# EAGLE design Teensy_v1.3 (EAGLE 7.7.0)
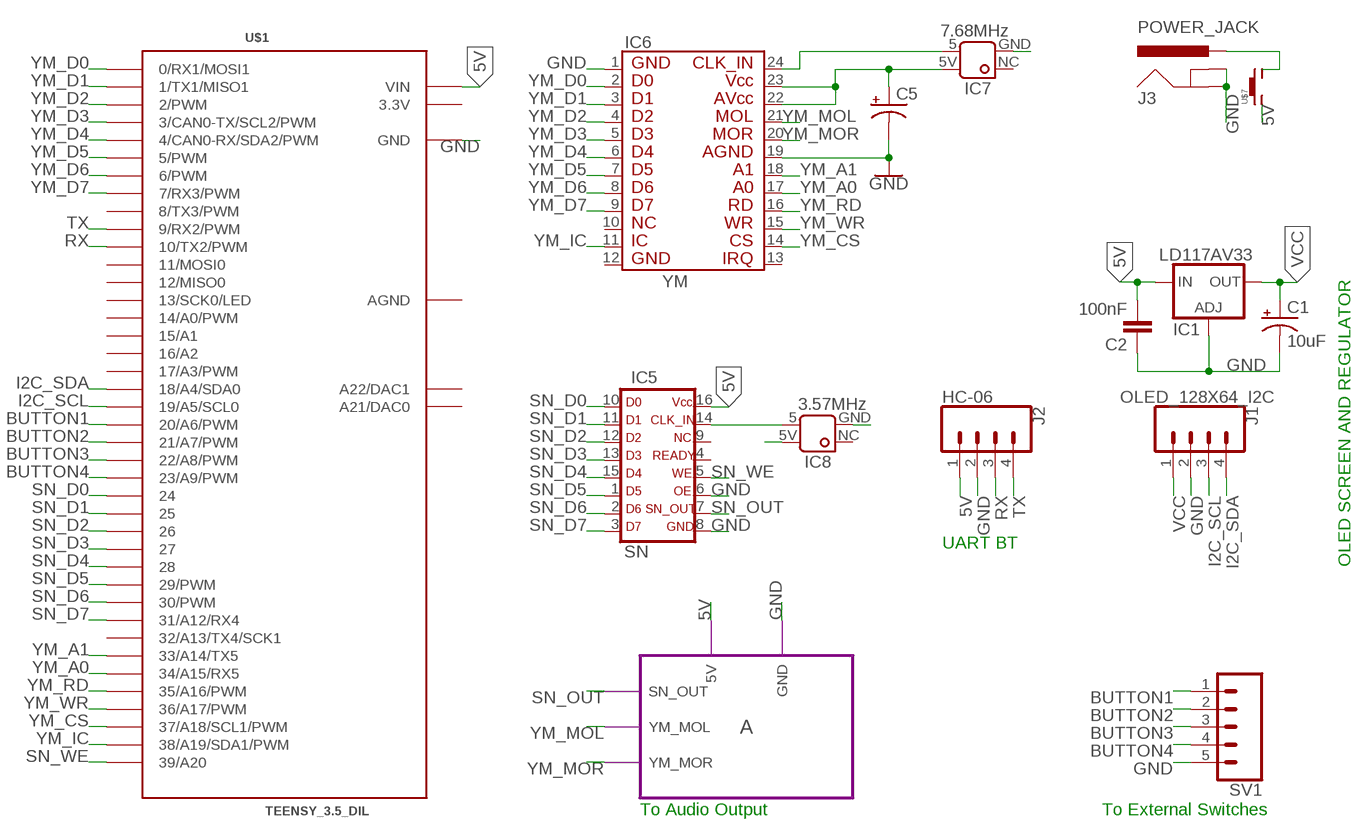
[diagram p0: schematic, sheet 1]

## Parts
C1  10uF  CPOL-USE2-5  [E2-5]
C2  100nF  C-EU025-025X050  [C025-025X050]
C5  1000uF  CPOL-USE5-10.5  [E5-10,5]
IC1  LD117AV33  [TO220L1]
IC5  SN  SN76489  [DIL16]
IC6  YM  YM2612-6  [DIL24-6]
IC7  7.68MHz  CLOCK_OSC  [DIL08-CLK]
IC8  3.57MHz  CLOCK_OSC  [DIL08-CLK]
J1  OLED_128X64_I2C  CONN_04  [1X04]
J2  HC-06  CONN_04  [1X04]
J3  POWER_JACK  [POWER_JACK_PTH]
SV1  CONN_05  [1X05]
U$1  TEENSY_3.5_DIL  [TEENSY_3.5_DIL]
U$7  GPTS20  [GPTS]

## Module instances
A = AMP

## Nets
5V [power]: C2.2 C5.+ IC1.3(IN) IC5.16(V) IC6.22 IC6.23 IC7.5V IC8.5V J2.1 U$1.VIN U$7.P$1 ; port A.5V
BUTTON1: SV1.1 U$1.20/A6(20/A6/PWM)
BUTTON2: SV1.2 U$1.21/A7(21/A7/PWM)
BUTTON3: SV1.3 U$1.22/A8(22/A8/PWM)
BUTTON4: SV1.4 U$1.23/A9(23/A9/PWM)
GND [power]: C1.- C2.1 C5.- IC1.1(ADJ) IC5.6(OE) IC5.8(GND) IC6.1 IC6.19 IC7.GND IC8.GND J1.2 J2.2 J3.GND J3.GNDBREAK SV1.5 U$1.GND U$1.GND1(GND) ; port A.GND
I2C_SCL: J1.3 U$1.19/A5(19/A5/SCL0)
I2C_SDA: J1.4 U$1.18/A4(18/A4/SDA0)
N$1: IC6.24 IC7.5
N$3 [power]: J3.PWR U$7.P$2
N$11: IC5.14(CLK) IC8.5
RX: J2.3 U$1.10(10/TX2/PWM)
SN_D0: IC5.10(D0) U$1.24
SN_D1: IC5.11(D1) U$1.25
SN_D2: IC5.12(D2) U$1.26
SN_D3: IC5.13(D3) U$1.27
SN_D4: IC5.15(D4) U$1.28
SN_D5: IC5.1(D5) U$1.29(29/PWM)
SN_D6: IC5.2(D6) U$1.30(30/PWM)
SN_D7: IC5.3(D7) U$1.31/A12(31/A12/RX4)
SN_OUT: IC5.7(SN) ; port A.SN_OUT
SN_WE: IC5.5(WE) U$1.39/A20
TX: J2.4 U$1.9(9/RX2/PWM)
VCC [power]: C1.+ IC1.2(OUT) J1.1
YM_A0: IC6.17 U$1.34/A15(34/A15/RX5)
YM_A1: IC6.18 U$1.33/A14(33/A14/TX5)
YM_CS: IC6.14 U$1.37/A18(37/A18/SCL1/PWM)
YM_D0: IC6.2 U$1.0(0/RX1/MOSI1)
YM_D1: IC6.3 U$1.1(1/TX1/MISO1)
YM_D2: IC6.4 U$1.2(2/PWM)
YM_D3: IC6.5 U$1.3(3/CAN0-TX/SCL2/PWM)
YM_D4: IC6.6 U$1.4(4/CAN0-RX/SDA2/PWM)
YM_D5: IC6.7 U$1.5(5/PWM)
YM_D6: IC6.8 U$1.6(6/PWM)
YM_D7: IC6.9 U$1.7(7/RX3/PWM)
YM_IC: IC6.11 U$1.38/A19(38/A19/SDA1/PWM)
YM_MOL: IC6.21 ; port A.YM_MOL
YM_MOR: IC6.20 ; port A.YM_MOR
YM_RD: IC6.16 U$1.35/A16(35/A16/PWM)
YM_WR: IC6.15 U$1.36/A17(36/A17/PWM)
Unconnected: IC5.4(RDY) IC5.9(NC) IC6.10 IC6.12 IC6.13 IC7.NC IC8.NC U$1.8(8/TX3/PWM) U$1.11(11/MOSI0) U$1.12(12/MISO0) U$1.13(13/SCK0/LED) U$1.14/A0(14/A0/PWM) U$1.15/A1 U$1.16/A2 U$1.17/A3(17/A3/PWM) U$1.32/A13(32/A13/TX4/SCK1) U$1.A21(A21/DAC0) U$1.A22(A22/DAC1)

## Notes on the sheet
- UART BT
- OLED SCREEN AND REGULATOR
- To Audio Output | To External Switches

## Power pins joined to a net without a drawn wire
3.3V: U$1.3.3V
AGND: U$1.AGND

## Library data of the parts
C1 = resistor:CPOL-US: POLARIZED CAPACITOR, American symbol; HEIGHT: 6.5
C2 = resistor:C-EU: CAPACITOR, European symbol; HEIGHT: 3
C5 = resistor:CPOL-US: POLARIZED CAPACITOR, American symbol; HEIGHT: 17.5
IC1 = v-reg:LD117A?*: Low drop fixed and adjustable positive voltage regulators 1 A Source: http://www.st.com/stonline/products/literature/ds/7194/ld1117axx.pdf
IC5 = Sega:SN76489: SN76489 Texas Instruments SN76489 PSG 16 DIP, Requires 3.57 MHz Clock 3 square wave tone generators. A wide range of frequencies. 16 different volume levels. 1 noise generator. 2 types (white noise and periodic). 3 different frequencies. 16 different volume levels. https://en.wikipedia.org/wiki/Texas_Instruments_SN76489; HEIGHT: 4.2
IC6 = Sega:YM2612: YM2612 Sound chip found in the Sega Genesis 24 DIP Package (OBN2); HEIGHT: 4.2
IC7 IC8 = Sega:CLOCK_OSC: CLOCK OSCILLATOR Dual In Line / Package; HEIGHT: 5.4
J1 J2 = SparkFun-Connectors:CONN_04: Multi connection point. Often used as Generic Header-pin footprint for 0.1 inch spaced/style header connections On any of the 0.1 inch spaced packages, you can populate with these: Break Away Headers - Straight <https://www.sparkfun.com/products/116> (PRT-00116) Break Away Male Headers - Right Angle <https://www.sparkfun.com/products/553> (PRT-00553) Female Headers <https://www.sparkfun.com/products/115> (PRT-00115) Break Away Headers - Machine Pin <https://www.sparkfun.com/products/117> (PRT-00117) Break Away Female Headers - Swiss Machine Pin <https://www.sparkfun.com/products/743> (PRT-00743) For SCREWTERMINALS and SPRING TERMINALS visit here: Screw Terimnals on SparkFun.com <https://www.sparkfun.com/search/results?term=Screw+Terminals> (5mm/3.5mm/2.54mm spacing) This device is also useful as a general connection point to wire up your design to another part of your project. Our various solder wires solder well into these plated through hole pads. Hook-Up Wire - Assortment (Stranded, 22 AWG) <https://www.sparkfun.com/products/11375> (PRT-11375) Hook-Up Wire - Assortment (Solid Core, 22 AWG) <https://www.sparkfun.com/products/11367> (PRT-11367) View the entire wire category on our website here <https://www.sparkfun.com/categories/141> Special notes: Molex polarized connector foot print use with SKU : PRT-08231 with associated crimp pins and housings. 1MM SMD Version SKU: PRT-10208; PROD_ID: CONN-09696
J3 = Sega:POWER_JACK: Power Jack Connector This is the standard 5.5mm barrel jack for power. The PTH is the most common, proven, reliable, footprint. The Slot footprint only works if the mill layer is transmitted to the PCB fab house so be warned. Here are the connectors we sell at SparkFun: DC Barrel Power Jack/Connector <https://www.sparkfun.com/products/119> (PRT-00119) DC Barrel Power Jack/Connector (SMD) <https://www.sparkfun.com/products/12748> (PRT-12748) DC Barrel Jack Adapter - Breadboard Compatible <https://www.sparkfun.com/products/10811> (PRT-10811) It is used on this SparkFun product (and many, many others): SparkFun RedBoard - Programmed with Arduino <https://www.sparkfun.com/products/12757> (DEV-12757) Also, if you need a mating power supply or connector, please check these out: Wall Adapter Power Supply - 9VDC 650mA <https://www.sparkfun.com/products/298> (TOL-00298) DC Barrel Jack Adapter - Male <https://www.sparkfun.com/products/10287> (PRT-10287); HEIGHT: 11
SV1 = SparkFun-Connectors:CONN_05: Multi connection point. Often used as Generic Header-pin footprint for 0.1 inch spaced/style header connections On any of the 0.1 inch spaced packages, you can populate with these: Break Away Headers - Straight <https://www.sparkfun.com/products/116> (PRT-00116) Break Away Male Headers - Right Angle <https://www.sparkfun.com/products/553> (PRT-00553) Female Headers <https://www.sparkfun.com/products/115> (PRT-00115) Break Away Headers - Machine Pin <https://www.sparkfun.com/products/117> (PRT-00117) Break Away Female Headers - Swiss Machine Pin <https://www.sparkfun.com/products/743> (PRT-00743) For SCREWTERMINALS and SPRING TERMINALS visit here: Screw Terimnals on SparkFun.com <https://www.sparkfun.com/search/results?term=Screw+Terminals> (5mm/3.5mm/2.54mm spacing) This device is also useful as a general connection point to wire up your design to another part of your project. Our various solder wires solder well into these plated through hole pads. Hook-Up Wire - Assortment (Stranded, 22 AWG) <https://www.sparkfun.com/products/11375> (PRT-11375) Hook-Up Wire - Assortment (Solid Core, 22 AWG) <https://www.sparkfun.com/products/11367> (PRT-11367) View the entire wire category on our website here <https://www.sparkfun.com/categories/141> Special notes: Molex polarized connector foot print use with SKU : PRT-08231 with associated crimp pins and housings. 1MM SMD Version SKU: PRT-10208
U$1 = Teensy_3_and_LC_Series_Boards_v1.4:TEENSY_3.5_DIL: DIL version of the Teensy 3.5; HEIGHT: 4.2
U$7 = Sega:GPTS20: PUSH BUTTON SPST GPTS203212B Digi-Key Part Number CW182-ND http://switches-connectors-custom.cwind.com/Asset/GPTS203212BR2.pdf; HEIGHT: 12

## Module AMP
Ports: SN_OUT(io) YM_MOL(io) YM_MOR(io) 5V(io) GND(io)
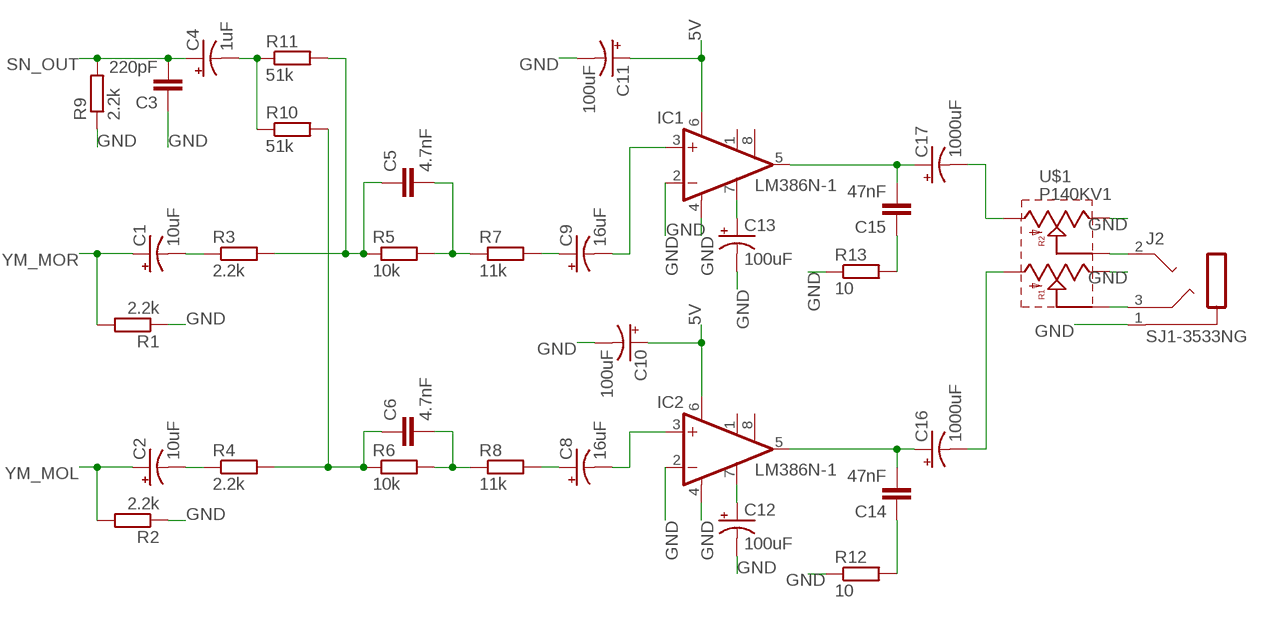
[diagram p1: schematic, module AMP, sheet 1]

### Parts
C1  10uF  CPOL-USE2-5  [E2-5]
C2  10uF  CPOL-USE2-5  [E2-5]
C3  220pF  C-EU025-025X050  [C025-025X050]
C4  1uF  CPOL-USE2-5  [E2-5]
C5  4.7nF  C-EU025-025X050  [C025-025X050]
C6  4.7nF  C-EU025-025X050  [C025-025X050]
C8  16uF  CPOL-USE5-10.5  [E5-10,5]
C9  16uF  CPOL-USE5-10.5  [E5-10,5]
C10  100uF  CPOL-USE2-5  [E2-5]
C11  100uF  CPOL-USE2-5  [E2-5]
C12  100uF  CPOL-USE2-5  [E2-5]
C13  100uF  CPOL-USE2-5  [E2-5]
C14  47nF  C-EU025-025X050  [C025-025X050]
C15  47nF  C-EU025-025X050  [C025-025X050]
C16  1000uF  CPOL-USE5-10.5  [E5-10,5]
C17  1000uF  CPOL-USE5-10.5  [E5-10,5]
IC1  LM386N-1  [DIL08]
IC2  LM386N-1  [DIL08]
J2  SJ1-3533NG  [SJ1-3533NG]
R1  2.2k  R-EU_0204/7  [0204/7]
R2  2.2k  R-EU_0204/7  [0204/7]
R3  2.2k  R-EU_0204/7  [0204/7]
R4  2.2k  R-EU_0204/7  [0204/7]
R5  10k  R-EU_0204/7  [0204/7]
R6  10k  R-EU_0204/7  [0204/7]
R7  11k  R-EU_0204/7  [0204/7]
R8  11k  R-EU_0204/7  [0204/7]
R9  2.2k  R-EU_0204/7  [0204/7]
R10  51k  R-EU_0204/7  [0204/7]
R11  51k  R-EU_0204/7  [0204/7]
R12  10  R-EU_0204/7  [0204/7]
R13  10  R-EU_0204/7  [0204/7]
U$1  P140KV1  [P14O]

### Nets
5V [power]: C10.+ C11.+ IC1.6(VS) IC2.6(VS)
GND [power]: C3.1 C10.- C11.- C12.- C13.- IC1.2(-IN) IC1.4(GND) IC2.2(-IN) IC2.4(GND) J2.1(S) R1.1 R2.1 R9.1 R12.1 R13.1 U$1.3 U$1.3'
N$1: C16.- U$1.1
N$2: C17.- U$1.1'
N$3: C15.2 C17.+ IC1.5(OUT)
N$4: C14.2 C16.+ IC2.5(OUT)
N$5: C13.+ IC1.7(BYPASS)
N$6: C12.+ IC2.7(BYPASS)
N$7: C9.- IC1.3(+IN)
N$8: C8.- IC2.3(+IN)
N$9: C9.+ R7.2
N$10: C8.+ R8.2
N$11: C15.1 R13.2
N$12: C14.1 R12.2
N$13: C6.1 R4.2 R6.1 R10.2
N$14: C5.1 R3.2 R5.1 R11.2
N$15: C4.- R10.1 R11.1
N$16: C1.- R3.1
N$17: C2.- R4.1
N$18: C5.2 R5.2 R7.1
N$19: C6.2 R6.2 R8.1
N$20: J2.2(T) U$1.2'
N$21: J2.3(R) U$1.2
SN_OUT: C3.2 C4.+ R9.2
YM_MOL: C2.+ R2.2
YM_MOR: C1.+ R1.2
Unconnected: IC1.1(GAIN) IC1.8(GAIN) IC2.1(GAIN) IC2.8(GAIN)

### Library data of the parts
C1 C2 = resistor:CPOL-US: POLARIZED CAPACITOR, American symbol; HEIGHT: 6.5
C3 C5 C6 C14 C15 = resistor:C-EU: CAPACITOR, European symbol; HEIGHT: 3
C4 = resistor:CPOL-US: POLARIZED CAPACITOR, American symbol
C8 C9 = resistor:CPOL-US: POLARIZED CAPACITOR, American symbol; HEIGHT: 26.5
C10 C11 = resistor:CPOL-US: POLARIZED CAPACITOR, American symbol; HEIGHT: 12.7
C12 C13 = resistor:CPOL-US: POLARIZED CAPACITOR, American symbol; HEIGHT: 12.5
C16 C17 = resistor:CPOL-US: POLARIZED CAPACITOR, American symbol; HEIGHT: 17.5
IC1 IC2 = linear:LM386?-*: Low Voltage Audio Power Amplifier Source: http://cache.national.com/ds/LM/LM386.pdf; HEIGHT: 4.2
J2 = con-cuistack:SJ1-3533NG: RIGHT ANGLE STEREO JACK 3.5mm; HEIGHT: 12.3
R1-R7 R9-R13 = resistor:R-EU_: RESISTOR, European symbol; HEIGHT: 1.5
R8 = resistor:R-EU_: RESISTOR, European symbol
U$1 = Sega:P140KV1: DUAL GANG POT 10K OHM 1/20W PLASTIC LINEAR DigiKEy PN:987-1296-ND http://www.ttelectronics.com/sites/default/files/download-files/Datasheet_RotaryPanelPot_P140series.pdf; HEIGHT: 16.7

## Net classes
0 default: width 0.61 mm
1 power: width 1.016 mm, clearance 0.254 mm

## Board
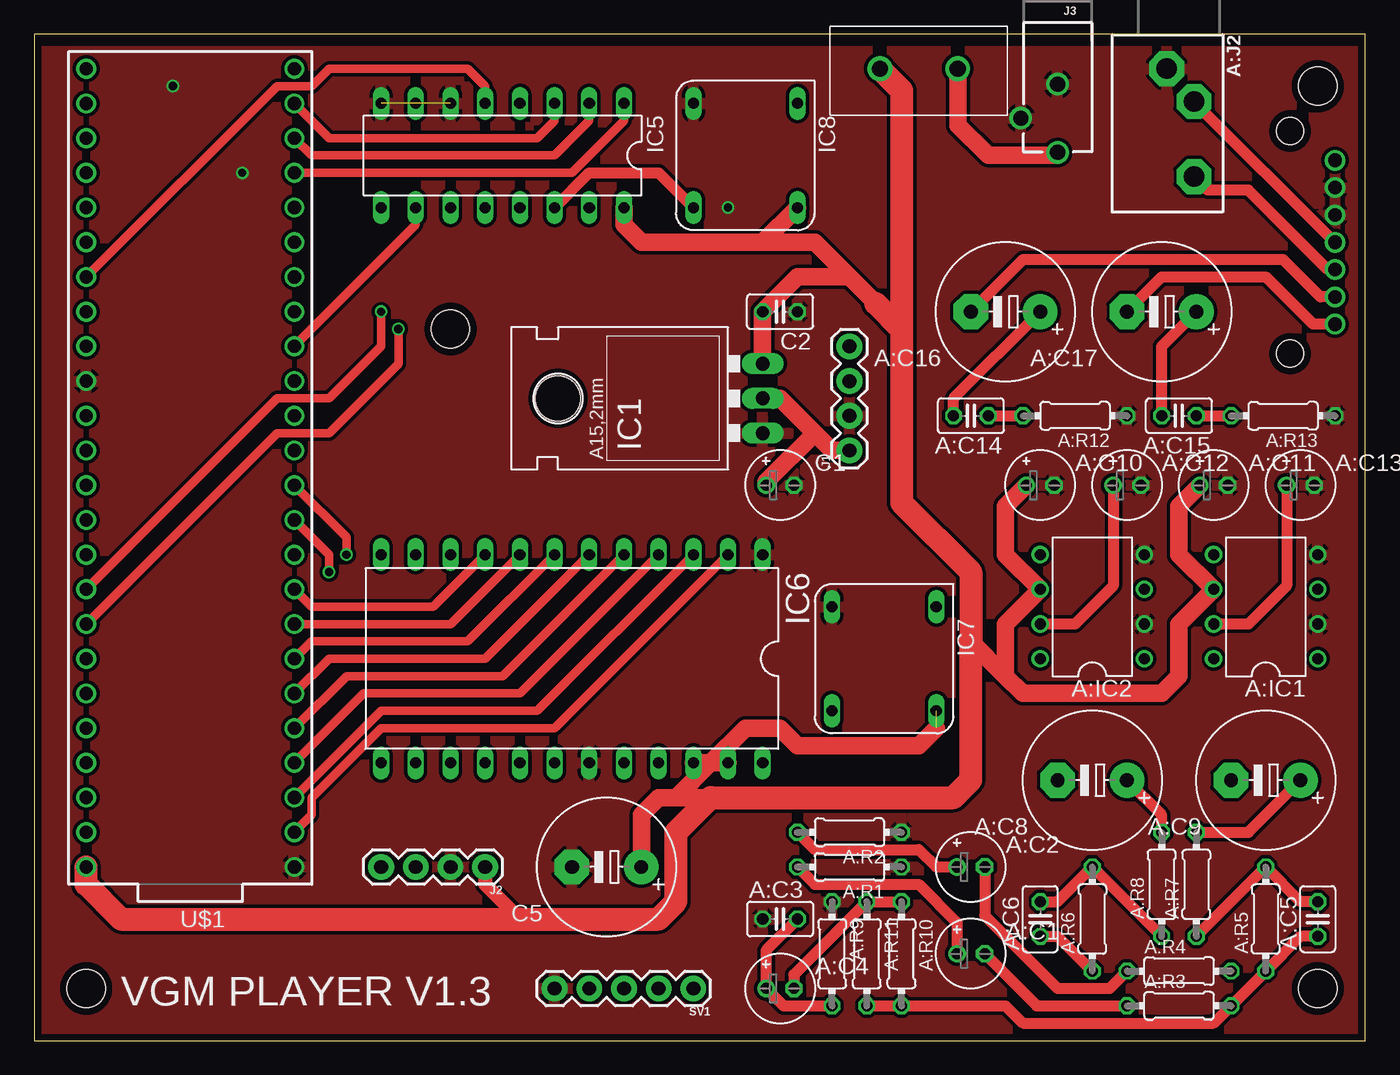
[diagram p2: board, top side]
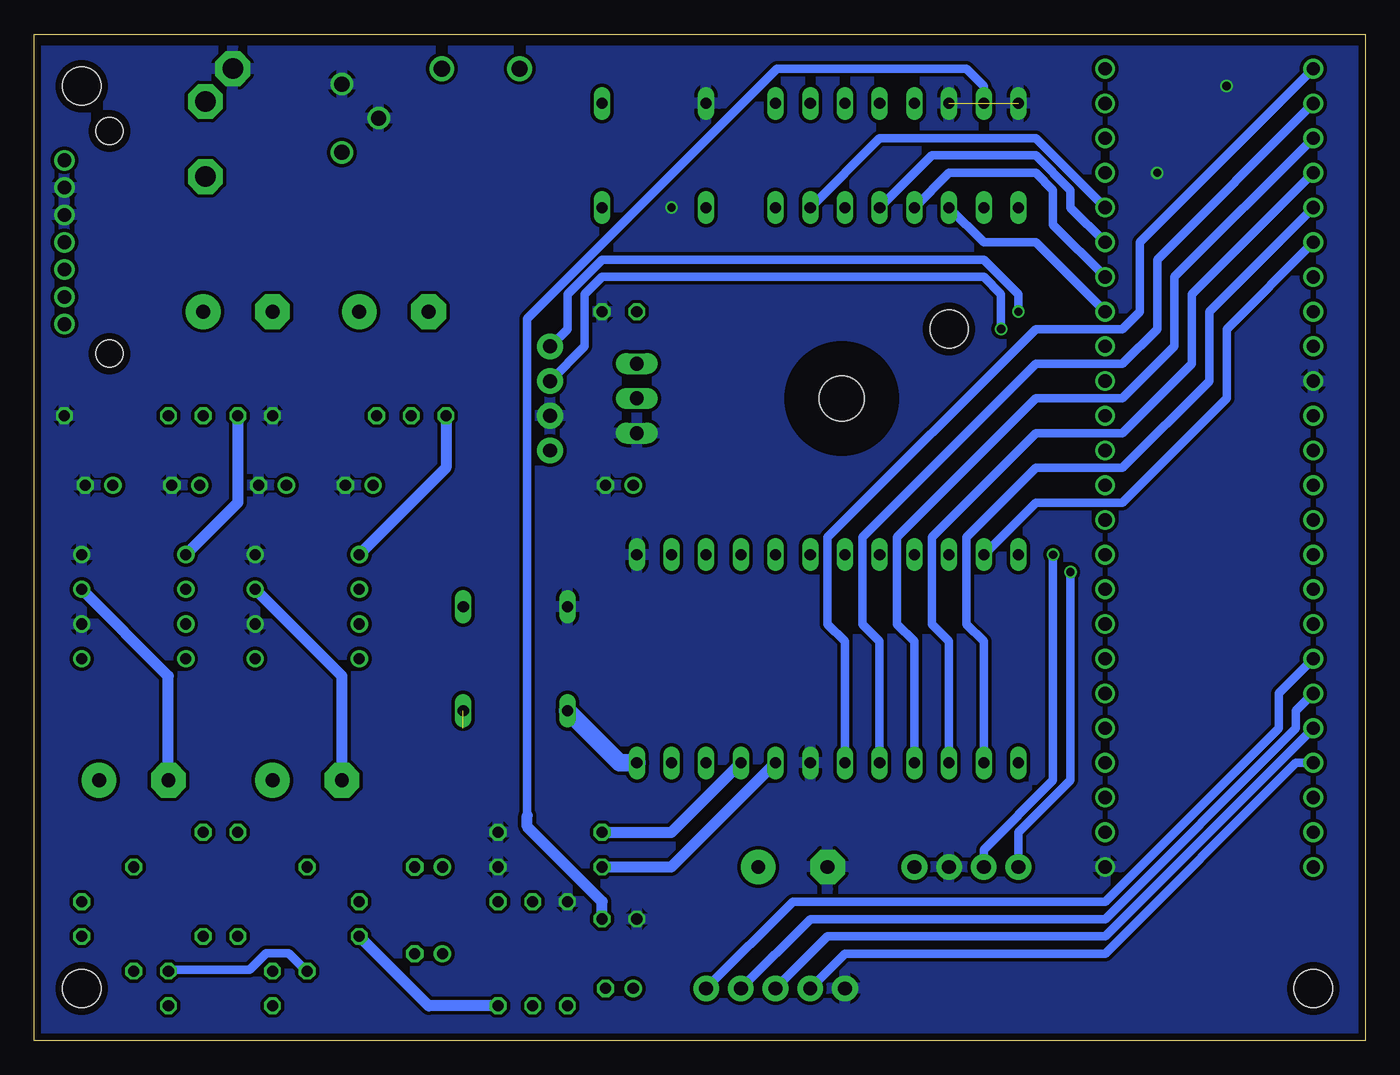
[diagram p3: board, bottom side, seen from below]

Size 97.46 x 73.65 mm. Coordinates in mm from the lower left corner, seen from the top.
Outline: 0,0 97.46,0 97.46,73.65 0,73.65 0,0
Copper layers (1*16): Top 0.035mm / dielectric 1.6mm / Bottom 0.035mm
Design rules "Elecrow_2-layer_PCB_eagle_rule": minimum track width 6mil, minimum drill 12mil, track to track 6mil, track to pad 6mil, pad to pad 6mil, via to via 8mil, smd to smd 0mil, copper to edge 20mil, drill to drill 10mil, minimum pad ring 6mil, minimum via ring 6mil, stop-mask expansion 0mil, vias tented up to drill 100mil, thermal gap 10mil
Holes 2.8 mm at 93.98,69.85 93.98,3.81 3.81,3.81 30.48,52.07

### Footprints (pad centres in the part's own frame; a part is rotated, then mirrored left to right if it is on the bottom)
E2-5 = drill 0.813 pad 1.27: + -1.016,0 | drill 0.813 pad 1.27 octagon: - 1.016,0
C025-025X050 = drill 0.813 octagon: 1 -1.27,0; 2 1.27,0
E5-10,5 = drill 1.016 pad 2.54: + -2.54,0 | drill 1.016 pad 2.54 octagon: - 2.54,0
DIL08 = drill 0.813 pad 1.27: 1 -3.81,-3.81; 2 -1.27,-3.81; 3 1.27,-3.81; 4 3.81,-3.81; 5 3.81,3.81; 6 1.27,3.81; 7 -1.27,3.81; 8 -3.81,3.81
SJ1-3533NG = drill 1.5 pad 2.54 octagon: 1 0,-0.9; 2 2.4,1.1; 3 7.9,1.1
0204/7 = drill 0.813 octagon: 1 -3.81,0; 2 3.81,0
P14O = drill 1: 1 -4,0; 1' -6,0; 2 -2,0; 2' 0,0; 3 2,0; 3' 4,0; NC 6,0 | hole 2: -8.15,3.3; 8.15,3.3
TO220L1 = drill 1.016 long: 1 -2.54,-3.81; 2 0,-3.81; 3 2.54,-3.81 | hole 3.302: 0,11.176
DIL16 = drill 0.813 long: 1 -8.89,-3.81; 2 -6.35,-3.81; 3 -3.81,-3.81; 4 -1.27,-3.81; 5 1.27,-3.81; 6 3.81,-3.81; 7 6.35,-3.81; 8 8.89,-3.81; 9 8.89,3.81; 10 6.35,3.81; 11 3.81,3.81; 12 1.27,3.81; 13 -1.27,3.81; 14 -3.81,3.81; 15 -6.35,3.81; 16 -8.89,3.81
DIL24-6 = drill 0.813 long: 1 -13.97,-7.62; 2 -11.43,-7.62; 3 -8.89,-7.62; 4 -6.35,-7.62; 5 -3.81,-7.62; 6 -1.27,-7.62; 7 1.27,-7.62; 8 3.81,-7.62; 9 6.35,-7.62; 10 8.89,-7.62; 11 11.43,-7.62; 12 13.97,-7.62; 13 13.97,7.62; 14 11.43,7.62; 15 8.89,7.62; 16 6.35,7.62; 17 3.81,7.62; 18 1.27,7.62; 19 -1.27,7.62; 20 -3.81,7.62; 21 -6.35,7.62; 22 -8.89,7.62; 23 -11.43,7.62; 24 -13.97,7.62
DIL08-CLK = drill 0.813 long: 5 3.81,3.81; 5V -3.81,3.81; GND 3.81,-3.81; NC -3.81,-3.81
1X04 = drill 1.016 pad 1.88: 1 0,0; 2 2.54,0; 3 5.08,0; 4 7.62,0
POWER_JACK_PTH = drill 1.1: GND 0,6.2; GNDBREAK 2.7,8.7; PWR 0,11.2
1X05 = drill 1.016 pad 1.88: 1 0,0; 2 2.54,0; 3 5.08,0; 4 7.62,0; 5 10.16,0
TEENSY_3.5_DIL = drill 0.965: 0 -7.62,26.67; 1 -7.62,24.13; 2 -7.62,21.59; 3 -7.62,19.05; 3.3V 7.62,24.13; 3.3V3 -7.62,-6.35; 4 -7.62,16.51; 5 -7.62,13.97; 6 -7.62,11.43; 7 -7.62,8.89; 8 -7.62,6.35; 9 -7.62,3.81; 10 -7.62,1.27; 11 -7.62,-1.27; 12 -7.62,-3.81; 13 7.62,-3.81; 14/A0 7.62,-1.27; 15/A1 7.62,1.27; 16/A2 7.62,3.81; 17/A3 7.62,6.35; 18/A4 7.62,8.89; 19/A5 7.62,11.43; 20/A6 7.62,13.97; 21/A7 7.62,16.51; 22/A8 7.62,19.05; 23/A9 7.62,21.59; 24 -7.62,-8.89; 25 -7.62,-11.43; 26 -7.62,-13.97; 27 -7.62,-16.51; 28 -7.62,-19.05; 29 -7.62,-21.59; 30 -7.62,-24.13; 31/A12 -7.62,-26.67; 32/A13 -7.62,-29.21; 33/A14 7.62,-29.21; 34/A15 7.62,-26.67; 35/A16 7.62,-24.13; 36/A17 7.62,-21.59; 37/A18 7.62,-19.05; 38/A19 7.62,-16.51; 39/A20 7.62,-13.97; A21 7.62,-11.43; A22 7.62,-8.89; AGND 7.62,26.67; GND -7.62,29.21; GND1 7.62,-6.35; VIN 7.62,29.21
GPTS = drill 1.2: P$1 -2.85,0; P$2 2.85,0

### Placement (x,y rotation side)
A:C1  10uF  [E2-5]  68.58,6.35 0 top
A:C2  10uF  [E2-5]  68.58,12.7 0 top
A:C3  220pF  [C025-025X050]  54.61,8.89 0 top
A:C4  1uF  [E2-5]  54.61,3.81 0 top
A:C5  4.7nF  [C025-025X050]  93.98,8.89 90 top
A:C6  4.7nF  [C025-025X050]  73.66,8.89 90 top
A:C8  16uF  [E5-10,5]  77.47,19.05 180 top
A:C9  16uF  [E5-10,5]  90.17,19.05 180 top
A:C10  100uF  [E2-5]  73.66,40.64 0 top
A:C11  100uF  [E2-5]  86.36,40.64 0 top
A:C12  100uF  [E2-5]  80.01,40.64 0 top
A:C13  100uF  [E2-5]  92.71,40.64 0 top
A:C14  47nF  [C025-025X050]  68.58,45.72 180 top
A:C15  47nF  [C025-025X050]  83.82,45.72 180 top
A:C16  1000uF  [E5-10,5]  71.12,53.34 180 top
A:C17  1000uF  [E5-10,5]  82.55,53.34 180 top
A:IC1  LM386N-1  [DIL08]  90.17,31.75 90 top
A:IC2  LM386N-1  [DIL08]  77.47,31.75 90 top
A:J2  SJ1-3533NG  [SJ1-3533NG]  83.82,71.12 270 top
A:R1  2.2k  [0204/7]  59.69,12.7 180 top
A:R2  2.2k  [0204/7]  59.69,15.24 180 top
A:R3  2.2k  [0204/7]  83.82,2.54 0 top
A:R4  2.2k  [0204/7]  83.82,5.08 0 top
A:R5  10k  [0204/7]  90.17,8.89 90 top
A:R6  10k  [0204/7]  77.47,8.89 90 top
A:R7  11k  [0204/7]  85.09,11.43 90 top
A:R8  11k  [0204/7]  82.55,11.43 90 top
A:R9  2.2k  [0204/7]  58.42,6.35 270 top
A:R10  51k  [0204/7]  63.5,6.35 270 top
A:R11  51k  [0204/7]  60.96,6.35 270 top
A:R12  10  [0204/7]  76.2,45.72 180 top
A:R13  10  [0204/7]  91.44,45.72 180 top
A:U$1  P140KV1  [P14O]  95.25,58.42 90 top
C1  54.61,40.64 0 top
C2  54.61,53.34 180 top
C5  41.91,12.7 180 top
IC1  49.53,46.99 90 top
IC5  34.29,64.77 180 top
IC6  39.37,27.94 180 top
IC7  62.23,27.94 180 top
IC8  52.07,64.77 180 top
J1  59.69,43.18 90 top
J2  33.02,12.7 180 top
J3  74.93,76.2 180 top
SV1  48.26,3.81 180 top
U$1  11.43,41.91 180 top
U$7  64.77,71.12 0 top

### Tracks (layer width: path | path; a pad name or v marks a point on that pad's centre or on a via)
5V  (1 unrouted)
  Top 1.016: J2.1 33.02,11.43 35.56,8.89
  Top 1.27: IC5.16 43.18,59.69 44.45,58.42 53.34,58.42 | 53.34,58.42 IC8.5V | IC1.3 C2.2 55.88,55.88 59.69,55.88 | 66.04,22.86 64.77,21.59 55.88,21.59 54.61,22.86 52.07,22.86 49.53,20.32 | A:C10.+ 71.12,39.12 71.12,35.56 A:IC2.6 71.12,30.48 71.12,26.67 | A:C11.+ 83.82,39.12 83.82,35.56 A:IC1.6 83.82,30.48 83.82,26.67 82.55,25.4 72.39,25.4 71.12,26.67 | 68.58,29.21 71.12,26.67 | 46.99,17.78 45.72,17.78 44.45,16.51 C5.+ | 46.99,17.78 49.53,20.32 | IC6.22 49.53,20.32 | 46.99,17.78 49.53,17.78 | IC6.23 49.53,20.32 | 59.69,55.88 61.62,53.95 | 53.34,58.42 57.15,58.42 59.69,55.88
  Top 1.676: U$1.VIN 3.81,11.43 6.35,8.89 35.56,8.89 45.72,8.89 46.99,10.16 46.99,15.24 49.53,17.78 67.31,17.78 68.58,19.05 68.58,29.21 68.58,34.29 63.5,39.37 63.5,52.07 | 61.62,53.95 63.5,52.07 | U$7.P$1 63.5,69.54 63.5,52.07
A:N$1
  Top 0.813: A:U$1.1 94.17,54.42 91.44,57.15 72.39,57.15 A:C16.-
A:N$2
  Top 0.813: A:C17.- 82.55,55.88 90.17,55.88 93.63,52.42 A:U$1.1'
A:N$3
  Top 0.813: A:C15.2 82.55,50.8 A:C17.+
  Bottom 0.813: A:C15.2 82.55,39.37 A:IC1.5
A:N$4
  Top 0.813: A:C14.2 67.31,46.99 A:C16.+
  Bottom 0.813: A:C14.2 67.31,41.91 A:IC2.5
A:N$5
  Top 0.813: A:C13.+ 91.69,33.27 88.9,30.48 A:IC1.7
A:N$6
  Top 0.813: A:C12.+ 78.99,33.27 76.2,30.48 A:IC2.7
A:N$7
  Bottom 0.813: A:C9.- 87.63,26.67 A:IC1.3
A:N$8
  Bottom 0.813: A:C8.- 74.93,26.67 A:IC2.3
A:N$9
  Top 0.813: A:R7.2 88.9,15.24 A:C9.+
A:N$10
  Top 0.813: A:R8.2 82.55,16.51 A:C8.+
A:N$11
  Top 0.813: A:C15.1 A:R13.2
A:N$12
  Top 0.813: A:C14.1 A:R12.2
A:N$13
  Top 0.813: A:C6.1 74.93,7.62 A:R6.1
  Bottom 0.61: A:R4.2 87.58,5.18 81.69,5.18 80.47,6.4 78.84,6.4 77.62,5.18 A:R6.1
  Bottom 0.813: A:R10.2 68.58,2.54 A:C6.1
A:N$14
  Top 0.813: A:C5.1 92.71,7.62 A:R5.1 A:R3.2 86.36,1.27 72.39,1.27 71.12,2.54 A:R11.2
A:N$15
  Top 0.813: A:R10.1 A:R11.1 55.63,4.83 A:C4.-
A:N$16
  Top 0.813: A:C1.- 73.41,2.54 A:R3.1
A:N$17
  Top 0.813: A:C2.- 69.6,9.14 74.93,3.81 78.74,3.81 A:R4.1
A:N$18
  Top 0.813: A:R7.1 A:R5.2 92.71,10.16 A:C5.2
A:N$19
  Top 0.813: A:R8.1 A:R6.2 74.93,10.16 A:C6.2
A:N$20
  Top 0.813: A:U$1.2' 95.22,58.42 A:J2.2
A:N$21
  Top 0.813: A:U$1.2 94.71,56.42 88.9,62.23 85.91,62.23 A:J2.3
BUTTON1
  Bottom 0.61: SV1.1 41.91,10.16 19.05,10.16 6.35,22.86 6.35,25.4 U$1.20/A6
BUTTON2
  Bottom 0.61: SV1.2 40.64,8.89 19.05,8.89 5.08,22.86 5.08,24.13 U$1.21/A7
BUTTON3
  Bottom 0.61: U$1.22/A8 19.05,7.62 39.37,7.62 SV1.3
BUTTON4
  Bottom 0.61: SV1.4 38.1,6.35 19.05,6.35 5.08,20.32 U$1.23/A9
GND  (via drill 0.6)  (1 unrouted)
  other vias: 50.8,60.96 15.24,63.5 10.16,69.85
  pour Bottom: 0,72.39 97.79,72.39 97.79,0 0,0
  pour Top: 0,72.39 97.79,72.39 97.79,0 0,0
I2C_SCL  (via drill 0.6)
  Top 0.61: U$1.19/A5 17.78,44.45 21.59,44.45 26.67,49.53 v26.67,52.07
  Bottom 0.61: J1.3 57.15,50.8 57.15,54.61 55.88,55.88 27.94,55.88 26.67,54.61 v26.67,52.07
I2C_SDA  (via drill 0.6)
  Top 0.61: U$1.18/A4 17.78,46.99 21.59,46.99 25.4,50.8 v25.4,53.34
  Bottom 0.61: J1.4 58.42,52.07 58.42,54.61 55.88,57.15 27.94,57.15 25.4,54.61 v25.4,53.34
N$1
  Bottom 1.27: IC7.5 54.61,20.32 IC6.24
N$3
  Top 1.27: U$7.P$2 67.62,67 69.85,64.77 74.7,64.77 J3.PWR
N$11
  Top 0.813: IC5.14 40.64,63.5 45.72,63.5 IC8.5
RX  (via drill 0.6)
  Top 0.61: U$1.10 22.86,36.83 v22.86,35.56
  Bottom 0.61: v22.86,35.56 22.86,19.05 27.94,13.97 J2.3
SN_D0
  Top 0.61: U$1.24 27.94,59.69 IC5.10
SN_D1
  Bottom 0.61: U$1.25 24.13,58.42 27.94,58.42 IC5.11
SN_D2
  Bottom 0.61: U$1.26 22.86,59.69 22.86,62.23 24.13,63.5 30.48,63.5 IC5.12
SN_D3
  Bottom 0.61: U$1.27 21.59,60.96 21.59,62.23 24.13,64.77 31.75,64.77 IC5.13
SN_D4
  Bottom 0.61: U$1.28 24.13,66.04 35.56,66.04 IC5.15
SN_D5
  Top 0.61: IC5.1 43.18,67.31 39.37,63.5 U$1.29
SN_D6
  Top 0.61: IC5.2 40.64,67.31 38.1,64.77 20.32,64.77 U$1.30
SN_D7
  Top 0.61: IC5.3 38.1,67.31 36.83,66.04 21.59,66.04 U$1.31/A12
SN_OUT
  Top 0.813: A:C3.2 53.59,6.6 A:C4.+ 54.86,2.54 A:R9.2
  Bottom 0.61: IC5.7 27.94,69.85 29.21,71.12 43.08,71.12 61.37,52.83 61.37,16.46
  Bottom 0.813: A:C3.2 55.88,10.16 61.37,15.65 61.37,16.46
SN_WE
  Top 0.61: IC5.5 33.02,69.85 31.75,71.12 21.59,71.12 20.32,69.85 17.78,69.85 U$1.39/A20
TX  (via drill 0.6)
  Top 0.61: U$1.9 21.59,35.56 v21.59,34.29
  Bottom 0.61: v21.59,34.29 21.59,19.05 25.4,15.24 J2.4
VCC
  Top 1.27: J1.1 58.42,43.18 57.15,44.45 | 57.15,44.45 54.61,46.99 IC1.2 | C1.+ 53.59,40.89 57.15,44.45
YM_A0
  Bottom 0.61: U$1.34/A15 15.24,57.15 15.24,52.07 17.78,49.53 24.13,49.53 36.83,36.83 36.83,30.48 35.56,29.21 IC6.17
YM_A1
  Bottom 0.61: U$1.33/A14 16.51,58.42 16.51,53.34 17.78,52.07 24.13,52.07 39.37,36.83 39.37,30.48 38.1,29.21 IC6.18
YM_CS
  Bottom 0.61: U$1.37/A18 11.43,53.34 11.43,48.26 17.78,41.91 24.13,41.91 29.21,36.83 29.21,30.48 27.94,29.21 IC6.14
YM_D0
  Top 0.61: IC6.2 38.1,22.86 25.4,22.86 20.32,17.78 20.32,16.51 U$1.0
YM_D1
  Top 0.61: IC6.3 36.83,24.13 25.4,24.13 U$1.1
YM_D2
  Top 0.61: IC6.4 35.56,25.4 24.13,25.4 U$1.2
YM_D3
  Top 0.61: IC6.5 34.29,26.67 22.86,26.67 U$1.3
YM_D4
  Top 0.61: IC6.6 33.02,27.94 21.59,27.94 U$1.4
YM_D5
  Top 0.61: IC6.7 31.75,29.21 20.32,29.21 U$1.5
YM_D6
  Top 0.61: IC6.8 30.48,30.48 U$1.6
YM_D7
  Top 0.61: IC6.9 29.21,31.75 20.32,31.75 U$1.7
YM_IC
  Bottom 0.61: U$1.38/A19 10.16,52.07 10.16,46.99 17.78,39.37 24.13,39.37 IC6.11
YM_MOL
  Top 0.813: A:R2.2 57.15,13.97 64.77,13.97 66.04,12.7 A:C2.+
  Bottom 0.813: A:R2.2 50.8,15.24 IC6.21
YM_MOR
  Top 0.813: A:R1.2 57.15,11.43 64.77,11.43 67.56,8.64 A:C1.+
  Bottom 0.813: A:R1.2 50.8,12.7 IC6.20
YM_RD
  Bottom 0.61: U$1.35/A16 13.97,55.88 13.97,50.8 17.78,46.99 24.13,46.99 34.29,36.83 34.29,30.48 33.02,29.21 IC6.16
YM_WR
  Bottom 0.61: U$1.36/A17 12.7,54.61 12.7,49.53 17.78,44.45 24.13,44.45 31.75,36.83 31.75,30.48 30.48,29.21 IC6.15

### Text on the board
tPlace: VGM PLAYER V1.3